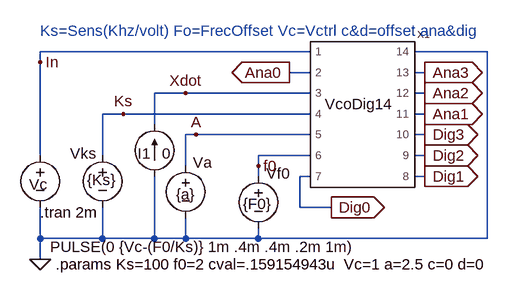
[diagram p0: schematic VcoJer14.asc]
VcoJer14.asc, the LTspice schematic file:
Version 4
SHEET 1 880 680
WIRE -304 160 -304 144
WIRE -304 304 -304 160
WIRE -304 432 -304 384
WIRE -304 464 -304 432
WIRE -208 304 -208 240
WIRE -208 432 -304 432
WIRE -208 432 -208 384
WIRE -176 240 -208 240
WIRE -128 256 -128 208
WIRE -128 432 -208 432
WIRE -128 432 -128 336
WIRE -80 208 -128 208
WIRE -80 320 -80 272
WIRE -80 432 -128 432
WIRE -80 432 -80 400
WIRE -64 272 -80 272
WIRE 32 320 32 304
WIRE 32 336 32 320
WIRE 32 432 -80 432
WIRE 32 432 32 416
WIRE 96 384 96 336
WIRE 112 144 -304 144
WIRE 112 176 80 176
WIRE 112 208 -80 208
WIRE 112 240 -176 240
WIRE 112 272 -64 272
WIRE 112 304 32 304
WIRE 112 336 96 336
WIRE 144 384 96 384
WIRE 288 176 272 176
WIRE 288 208 272 208
WIRE 288 240 272 240
WIRE 288 272 272 272
WIRE 288 304 272 304
WIRE 288 336 272 336
WIRE 384 144 272 144
WIRE 384 432 32 432
WIRE 384 432 384 144
FLAG -304 464 0
FLAG 80 176 Ana0
IOPIN 80 176 Out
FLAG -304 160 In
FLAG -176 240 Ks
FLAG -80 208 Xdot
FLAG -64 272 A
FLAG 32 320 f0
FLAG 144 384 Dig0
IOPIN 144 384 Out
FLAG 288 336 Dig1
IOPIN 288 336 Out
FLAG 288 304 Dig2
IOPIN 288 304 Out
FLAG 288 272 Dig3
IOPIN 288 272 Out
FLAG 288 240 Ana1
IOPIN 288 240 Out
FLAG 288 208 Ana2
IOPIN 288 208 Out
FLAG 288 176 Ana3
IOPIN 288 176 Out
SYMBOL voltage -304 288 R0
WINDOW 0 -17 61 Left 0
WINDOW 123 0 0 Left 0
WINDOW 39 0 0 Left 0
WINDOW 3 485 157 Right 0
SYMATTR InstName Vc
SYMATTR Value PULSE(0 {Vc-(F0/Ks)} 1m .4m .4m .2m 1m)
SYMBOL voltage -208 288 R0
WINDOW 0 -50 13 Left 0
WINDOW 123 0 0 Left 0
WINDOW 39 0 0 Left 0
WINDOW 3 -24 54 Left 0
SYMATTR InstName Vks
SYMATTR Value {Ks}
SYMBOL voltage 32 320 R0
WINDOW 0 12 12 Left 0
WINDOW 123 0 0 Left 0
WINDOW 39 0 0 Left 0
WINDOW 3 -24 59 Left 0
SYMATTR InstName Vf0
SYMATTR Value {F0}
SYMBOL voltage -80 304 R0
WINDOW 0 11 11 Left 0
WINDOW 123 0 0 Left 0
WINDOW 39 0 0 Left 0
WINDOW 3 -15 60 Left 0
SYMATTR InstName Va
SYMATTR Value {a}
SYMBOL vcodig14 192 224 R0
SYMATTR InstName X1
SYMBOL current -128 336 R180
WINDOW 123 0 0 Left 0
WINDOW 39 0 0 Left 0
WINDOW 0 6 35 Left 0
WINDOW 3 -25 35 Left 0
SYMATTR InstName I1
SYMATTR Value 0
TEXT -304 392 Left 0 !.tran 2m
TEXT -280 472 Left 0 !.params Ks=100 f0=2 cval=.159154943u  Vc=1 a=2.5 c=0 d=0
TEXT -304 112 Left 0 ;Ks=Sens(Khz/volt) Fo=FrecOffset Vc=Vctrl c&d=offset ana&dig

The netlist it stands for:
* VcoJer14.asc
Vc In 0 PULSE(0 {Vc-(F0/Ks)} 1m .4m .4m .2m 1m)
Vks Ks 0 {Ks}
Vf0 f0 0 {F0}
Va A 0 {a}
XX1 In Ana0 Xdot Ks A f0 Dig0 Dig1 Dig2 Dig3 Ana1 Ana2 Ana3 0 vcodig14 params: VcoDig14  ; pins 1 2 3 4 5 6 7 8 9 10 11 12 13 14
I1 0 Xdot 0
.tran 2m
.params Ks=100 f0=2 cval=.159154943u  Vc=1 a=2.5 c=0 d=0
* Ks=Sens(Khz/volt) Fo=FrecOffset Vc=Vctrl c&d=offset ana&dig
.backanno
.end